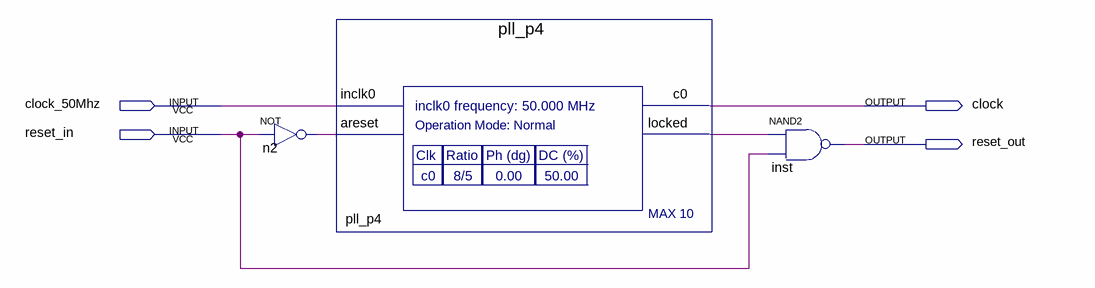
[diagram p0: schematic sheet]
// Quartus schematic clock_control.bdf as structural Verilog: 3 symbols, 4 pins
module clock_control (
  input  clock_50Mhz,
  input  reset_in,
  output clock,
  output reset_out
);

  wire n2_out, pll_p4_locked;

  not n2 (n2_out, reset_in);
  pll_p4 pll_p4 (.inclk0(clock_50Mhz), .areset(n2_out), .c0(clock), .locked(pll_p4_locked));
  nand inst (reset_out, pll_p4_locked, reset_in);
endmodule
